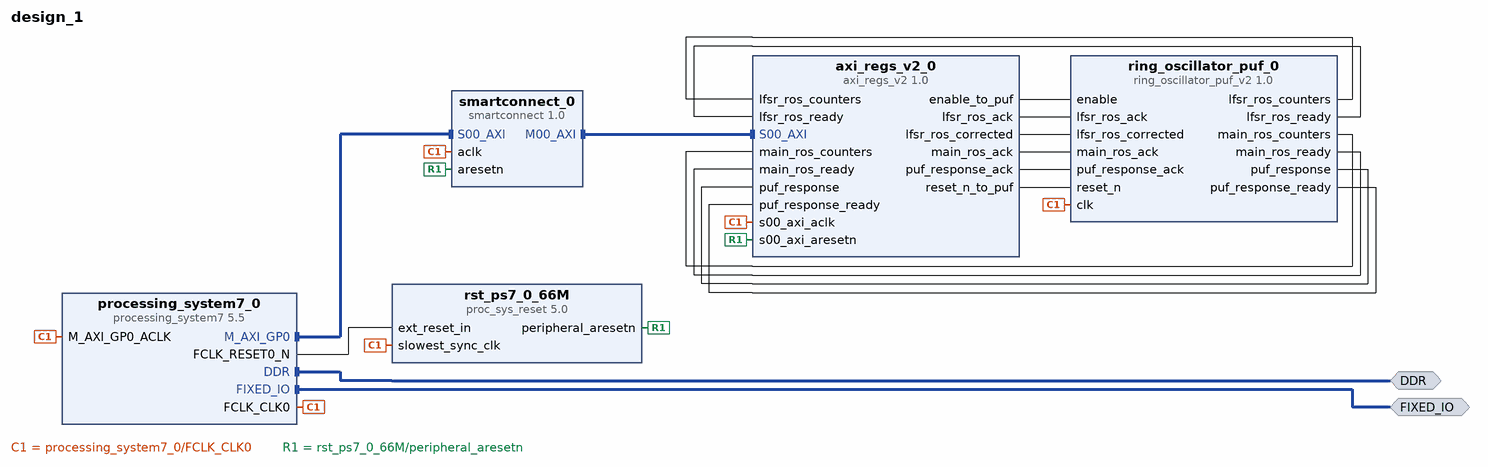
[diagram p0: block diagram of the top level]
# Vivado block design design_1, xc7z020clg400-1, Vivado 2022.1
create_bd_design design_1

create_bd_intf_port -mode Master -vlnv xilinx.com:interface:ddrx_rtl:1.0 DDR
create_bd_intf_port -mode Master -vlnv xilinx.com:display_processing_system7:fixedio_rtl:1.0 FIXED_IO

create_bd_cell -type ip -vlnv xilinx.com:ip:processing_system7:5.5 processing_system7_0
set_property -dict [list \
  CONFIG.PCW_APU_PERIPHERAL_FREQMHZ 666.666666 \
  CONFIG.PCW_CAN0_CAN0_IO {MIO 46 .. 47} \
  CONFIG.PCW_CAN0_PERIPHERAL_ENABLE 1 \
  CONFIG.PCW_CAN_PERIPHERAL_FREQMHZ 23.8095 \
  CONFIG.PCW_CRYSTAL_PERIPHERAL_FREQMHZ 50 \
  CONFIG.PCW_ENET0_ENET0_IO {MIO 16 .. 27} \
  CONFIG.PCW_ENET0_GRP_MDIO_ENABLE 1 \
  CONFIG.PCW_ENET0_GRP_MDIO_IO {MIO 52 .. 53} \
  CONFIG.PCW_ENET0_PERIPHERAL_ENABLE 1 \
  CONFIG.PCW_ENET0_PERIPHERAL_FREQMHZ {100 Mbps} \
  CONFIG.PCW_FPGA0_PERIPHERAL_FREQMHZ 50 \
  CONFIG.PCW_FPGA1_PERIPHERAL_FREQMHZ 50 \
  CONFIG.PCW_GPIO_EMIO_GPIO_ENABLE 1 \
  CONFIG.PCW_GPIO_EMIO_GPIO_IO 8 \
  CONFIG.PCW_GPIO_EMIO_GPIO_WIDTH 8 \
  CONFIG.PCW_GPIO_MIO_GPIO_ENABLE 0 \
  CONFIG.PCW_I2C0_GRP_INT_ENABLE 0 \
  CONFIG.PCW_I2C0_I2C0_IO {MIO 50 .. 51} \
  CONFIG.PCW_I2C0_PERIPHERAL_ENABLE 1 \
  CONFIG.PCW_I2C_PERIPHERAL_FREQMHZ 108.333336 \
  CONFIG.PCW_PERIPHERAL_BOARD_PRESET part0 \
  CONFIG.PCW_PRESET_BANK0_VOLTAGE {LVCMOS 1.8V} \
  CONFIG.PCW_PRESET_BANK1_VOLTAGE {LVCMOS 1.8V} \
  CONFIG.PCW_QSPI_GRP_FBCLK_ENABLE 1 \
  CONFIG.PCW_QSPI_GRP_FBCLK_IO {MIO 8} \
  CONFIG.PCW_QSPI_GRP_SINGLE_SS_ENABLE 1 \
  CONFIG.PCW_QSPI_GRP_SINGLE_SS_IO {MIO 1 .. 6} \
  CONFIG.PCW_QSPI_PERIPHERAL_ENABLE 1 \
  CONFIG.PCW_QSPI_QSPI_IO {MIO 1 .. 6} \
  CONFIG.PCW_SD0_GRP_CD_ENABLE 1 \
  CONFIG.PCW_SD0_GRP_CD_IO {MIO 0} \
  CONFIG.PCW_SD0_GRP_WP_ENABLE 1 \
  CONFIG.PCW_SD0_GRP_WP_IO {MIO 15} \
  CONFIG.PCW_SD0_PERIPHERAL_ENABLE 1 \
  CONFIG.PCW_SD0_SD0_IO {MIO 40 .. 45} \
  CONFIG.PCW_SDIO_PERIPHERAL_FREQMHZ 50 \
  CONFIG.PCW_SINGLE_QSPI_DATA_MODE x4 \
  CONFIG.PCW_UART1_PERIPHERAL_ENABLE 1 \
  CONFIG.PCW_UART1_UART1_IO {MIO 48 .. 49} \
  CONFIG.PCW_UART_PERIPHERAL_FREQMHZ 50 \
  CONFIG.PCW_UIPARAM_DDR_FREQ_MHZ 533.333333 \
  CONFIG.PCW_UIPARAM_DDR_PARTNO {MT41J256M8 HX-15E} \
  CONFIG.PCW_USB0_PERIPHERAL_ENABLE 1 \
  CONFIG.PCW_USB0_USB0_IO {MIO 28 .. 39} \
  CONFIG.preset ZC702 \
] [get_bd_cells processing_system7_0]
# 481 more settings of processing_system7_0 are not shown: defaults, MIO pin electricals, DDR timing, and values the tool derives
create_bd_cell -type ip -vlnv xilinx.com:ip:smartconnect:1.0 smartconnect_0
set_property -dict {CONFIG.NUM_SI 1} [get_bd_cells smartconnect_0]
create_bd_cell -type ip -vlnv xilinx.com:ip:proc_sys_reset:5.0 rst_ps7_0_66M
create_bd_cell -type ip -vlnv xilinx.com:user:axi_regs_v2:1.0 axi_regs_v2_0
create_bd_cell -type ip -vlnv xilinx.com:user:ring_oscillator_puf_v2:1.0 ring_oscillator_puf_0

# ---- connections ----

connect_bd_intf_net [get_bd_intf_ports DDR] [get_bd_intf_pins processing_system7_0/DDR]
connect_bd_intf_net [get_bd_intf_ports FIXED_IO] [get_bd_intf_pins processing_system7_0/FIXED_IO]
connect_bd_intf_net [get_bd_intf_pins processing_system7_0/M_AXI_GP0] [get_bd_intf_pins smartconnect_0/S00_AXI]
connect_bd_intf_net [get_bd_intf_pins smartconnect_0/M00_AXI] [get_bd_intf_pins axi_regs_v2_0/S00_AXI]
connect_bd_net [get_bd_pins axi_regs_v2_0/enable_to_puf] [get_bd_pins ring_oscillator_puf_0/enable]
connect_bd_net [get_bd_pins axi_regs_v2_0/lfsr_ros_ack] [get_bd_pins ring_oscillator_puf_0/lfsr_ros_ack]
connect_bd_net [get_bd_pins axi_regs_v2_0/lfsr_ros_corrected] [get_bd_pins ring_oscillator_puf_0/lfsr_ros_corrected]
connect_bd_net [get_bd_pins axi_regs_v2_0/main_ros_ack] [get_bd_pins ring_oscillator_puf_0/main_ros_ack]
connect_bd_net [get_bd_pins axi_regs_v2_0/puf_response_ack] [get_bd_pins ring_oscillator_puf_0/puf_response_ack]
connect_bd_net [get_bd_pins axi_regs_v2_0/reset_n_to_puf] [get_bd_pins ring_oscillator_puf_0/reset_n]
connect_bd_net [get_bd_pins processing_system7_0/FCLK_CLK0] \
  [get_bd_pins smartconnect_0/aclk] [get_bd_pins rst_ps7_0_66M/slowest_sync_clk] \
  [get_bd_pins processing_system7_0/M_AXI_GP0_ACLK] [get_bd_pins axi_regs_v2_0/s00_axi_aclk] \
  [get_bd_pins ring_oscillator_puf_0/clk]
connect_bd_net [get_bd_pins processing_system7_0/FCLK_RESET0_N] [get_bd_pins rst_ps7_0_66M/ext_reset_in]
connect_bd_net [get_bd_pins ring_oscillator_puf_0/lfsr_ros_counters] [get_bd_pins axi_regs_v2_0/lfsr_ros_counters]
connect_bd_net [get_bd_pins ring_oscillator_puf_0/lfsr_ros_ready] [get_bd_pins axi_regs_v2_0/lfsr_ros_ready]
connect_bd_net [get_bd_pins ring_oscillator_puf_0/main_ros_counters] [get_bd_pins axi_regs_v2_0/main_ros_counters]
connect_bd_net [get_bd_pins ring_oscillator_puf_0/main_ros_ready] [get_bd_pins axi_regs_v2_0/main_ros_ready]
connect_bd_net [get_bd_pins ring_oscillator_puf_0/puf_response] [get_bd_pins axi_regs_v2_0/puf_response]
connect_bd_net [get_bd_pins ring_oscillator_puf_0/puf_response_ready] [get_bd_pins axi_regs_v2_0/puf_response_ready]
connect_bd_net [get_bd_pins rst_ps7_0_66M/peripheral_aresetn] [get_bd_pins smartconnect_0/aresetn] [get_bd_pins axi_regs_v2_0/s00_axi_aresetn]

# ---- address map ----
assign_bd_address -offset 0x43C00000 -range 64K -target_address_space [get_bd_addr_spaces processing_system7_0/Data] [get_bd_addr_segs axi_regs_v2_0/S00_AXI/S00_AXI_reg]

validate_bd_design
save_bd_design
